# EasyEDA schematic SCH_SLV262-树莓派机房巡检小车_2026-06-26.json
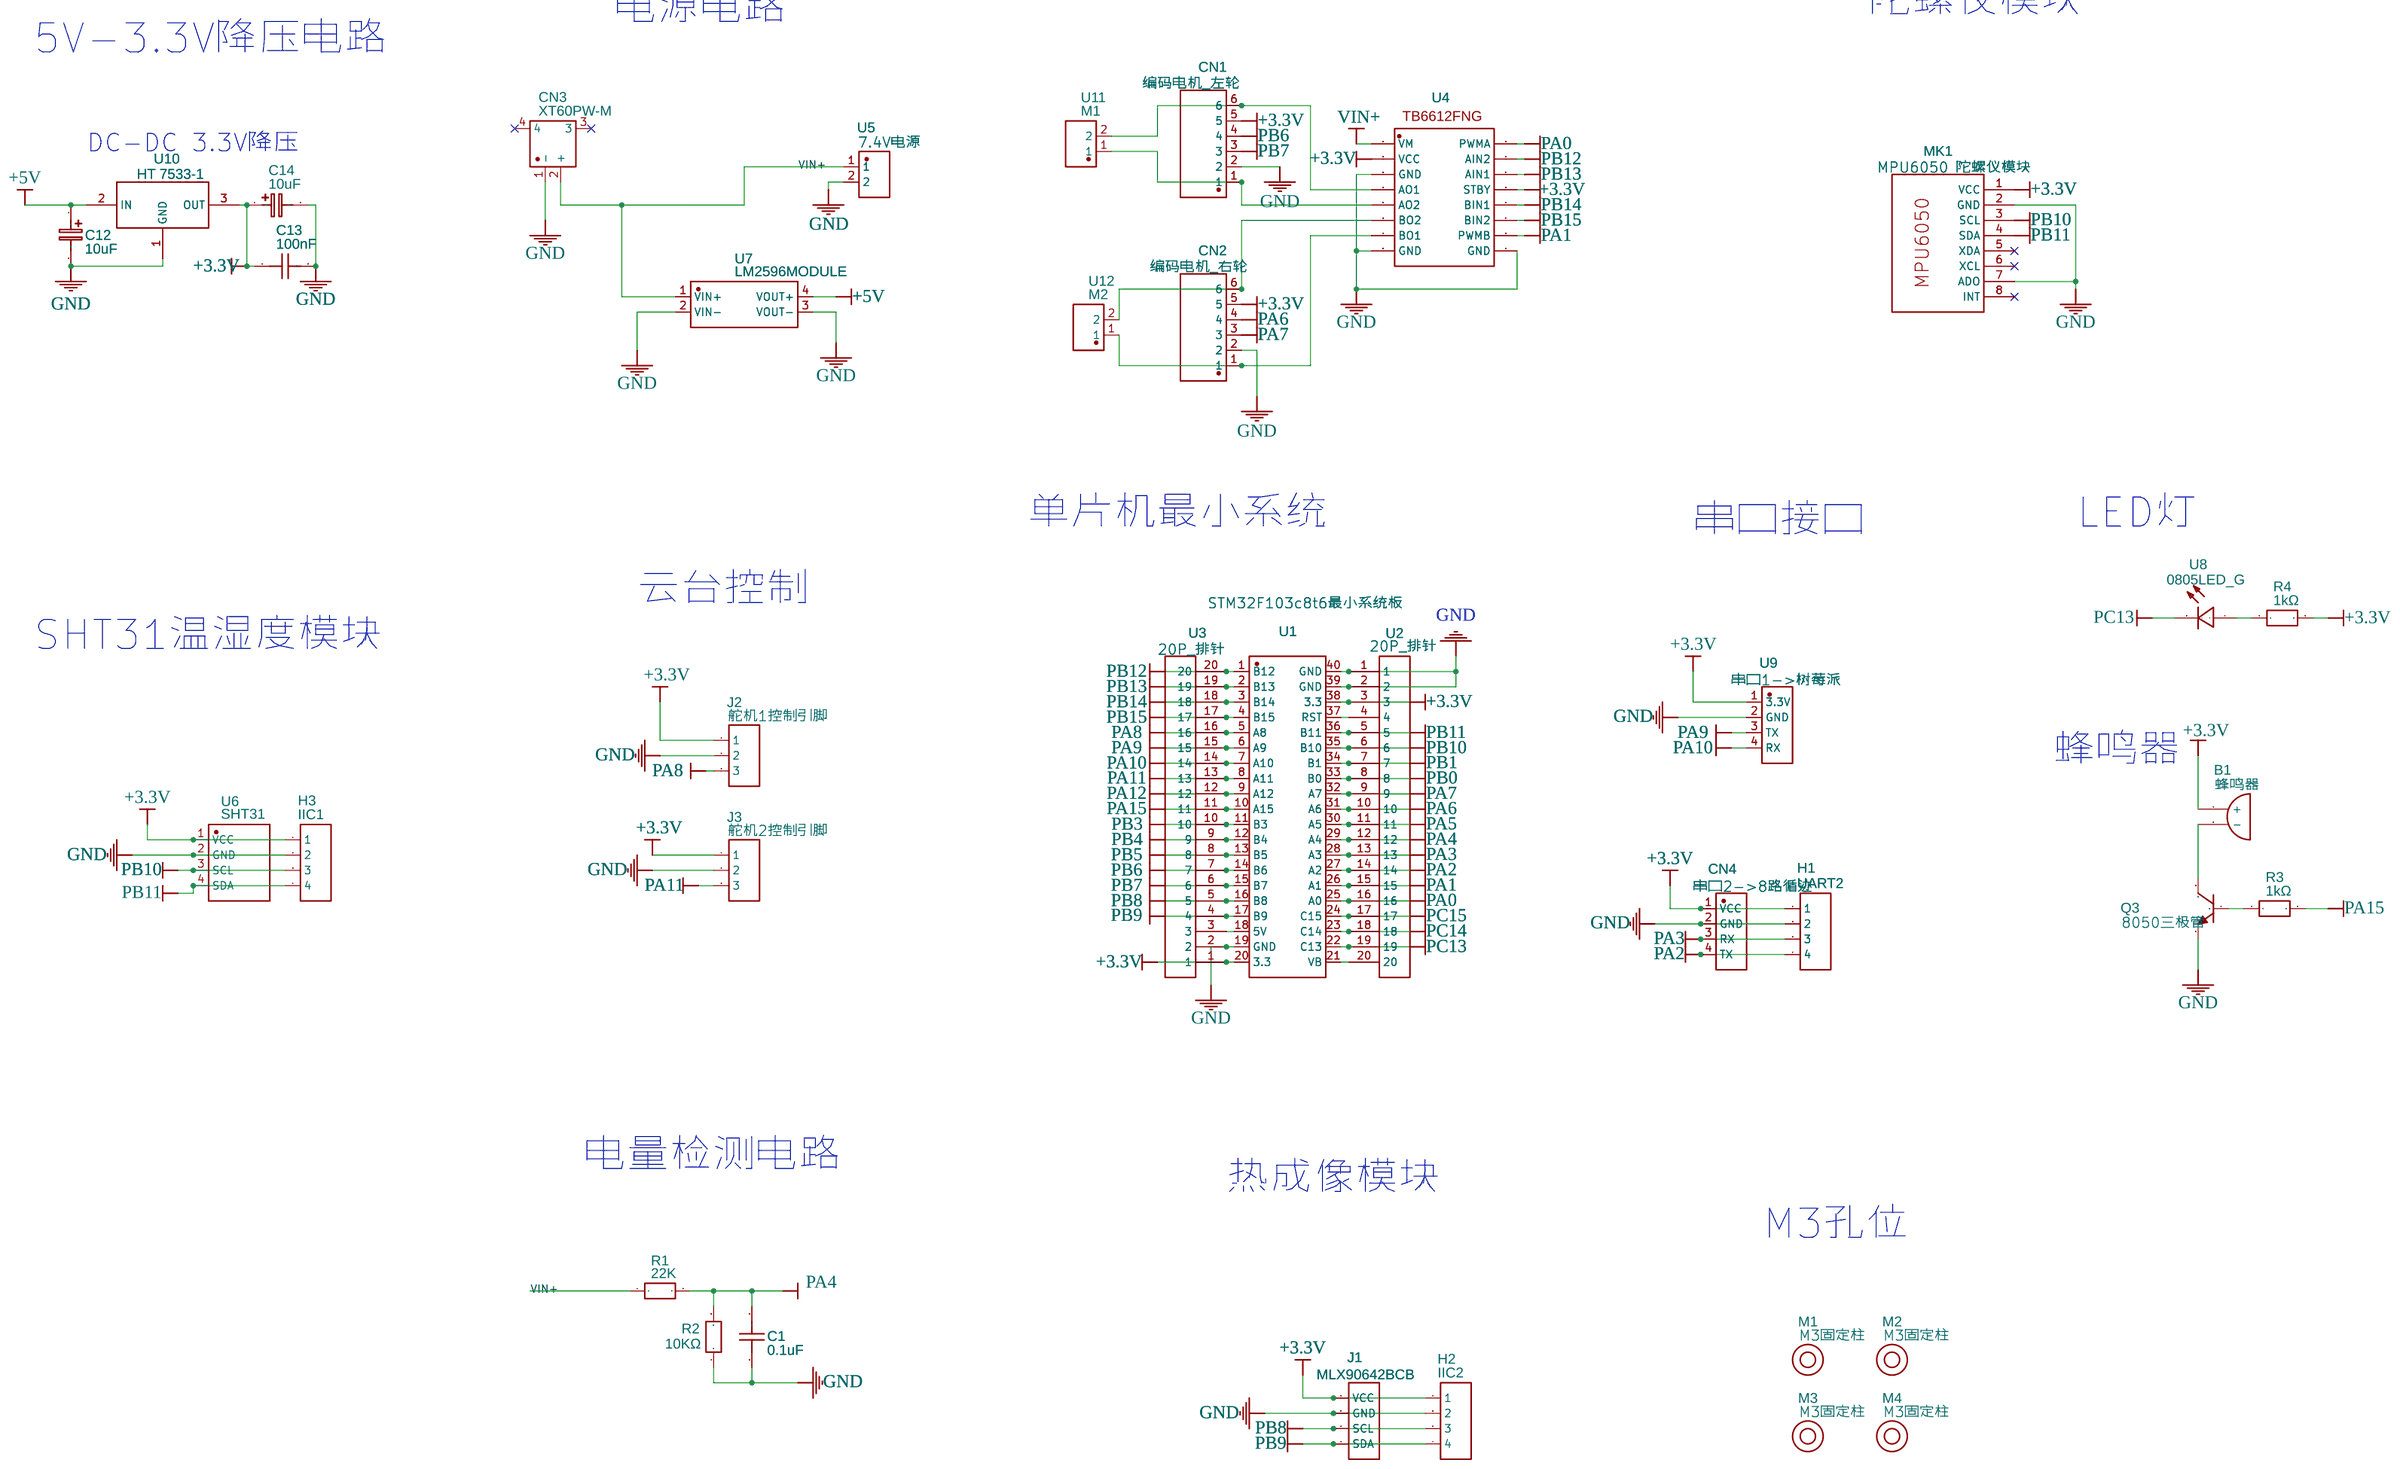
[diagram p0: schematic sheet]

## Parts
B1  蜂鸣器  [蜂鸣器-直插-无源蜂鸣器]
C1  0.1uF  [C0603]
C12  10uF  [CASE-A_3216]
C13  100nF  [C0603]
C14  10uF  [CASE-A_3216]
CN1  编码电机_左轮  [CONN-TH_A2501WV-6P]
CN2  编码电机_右轮  [CONN-TH_A2501WV-6P]
CN3  XT60PW-M  [CONN-TH_XT60PW-M]
CN4  串口2->8路循迹  [CONN-TH_HX-PH2.0-4PWZ]
H1  UART2  [HDR-F-2.54_1X4]
H2  IIC2  [HDR-F-2.54_1X4]
H3  IIC1  [HDR-F-2.54_1X4]
J1  MLX90642BCB  [HDR-M-2.54_1X4]
J2  舵机1控制引脚  [HDR-M-2.54_1X3]
J3  舵机2控制引脚  [HDR-M-2.54_1X3]
M1  M3固定柱  [M3螺丝孔外直径6MM-带8小孔]
M2  M3固定柱  [M3螺丝孔外直径6MM-带8小孔]
M3  M3固定柱  [M3螺丝孔外直径6MM-带8小孔]
M4  M3固定柱  [M3螺丝孔外直径6MM-带8小孔]
MK1  MPU6050 陀螺仪模块  [MPU6050 陀螺仪模块]
Q3  8050三极管  [TO-92-3_L4.8-W3.7-P1.27-L]
R1  22K  [R0603]
R2  10KΩ  [R0603]
R3  1kΩ  [R0603电阻]
R4  1kΩ  [R0603电阻]
U1  STM32F103c8t6最小系统板  [STM32F103C8T6最小系统板]
U2  20P_排针  [20P排针]
U3  20P_排针  [20P排针]
U4  TB6612  [TB6612]
U5  7.4V电源  [CONN-TH_P5.00_KF301-5.0-2P]
U6  SHT31  [SHT31]
U7  LM2596MODULE  [LM2596降压模块]
U8  0805LED_G  [LED-SMD_L2.0-W1.3-R-RD]
U9  串口1->树莓派  [CONN-TH_4P-P2.50-XH2.54-4P]
U10  HT 7533-1  [HT7533-1]
U11  M1  [CONN-TH_P5.00_KF301-5.0-2P]
U12  M2  [CONN-TH_P5.00_KF301-5.0-2P]

## Library data of the parts
B1 = 蜂鸣器: Contributor: huohuohuoo
C1 C13 = C_0603_US: Contributor: LCEDA_Lib
C12 C14 = C_Tan_SMD_A_EU: Contributor: LCEDA_Lib
CN1 CN2 = A2501WV-6P: Contributor: LCSC; Supplier: LCSC; Supplier Part: C225392; Manufacturer: CJT(长江连接器); JLCPCB Part Class: Extended Part
CN3 = XT60PW-M: Contributor: LCSC; Supplier: LCSC; Supplier Part: C98732; Manufacturer: AMASS(艾迈斯); JLCPCB Part Class: Extended Part
CN4 = HX-PH2.0-4PWZ: Supplier: LCSC; Supplier Part: C48641676; Manufacturer: hanxia(韩下); JLCPCB Part Class: Extended Part; Contributor: lcsc
H1-H3 = HDR-F-2.54_1x4: Supplier Part: C225501; Supplier: LCSC; Contributor: LCEDA_Lib
J1 = HDR-M-2.54_1x4: Supplier Part: C124378; Supplier: LCSC; Contributor: LCEDA_Lib
J2 J3 = HDR-M-2.54_1x3: Supplier Part: C180248; Supplier: LCSC; Contributor: LCEDA_Lib
M1-M4 = M3固定柱: Contributor: lazyshark
MK1 = MPU6050 陀螺仪模块: Contributor: lzlyyds
Q3 = 8050三极管: Supplier: LCSC; Supplier Part: C903227; Manufacturer: onsemi(安森美); Manufacturer Part: SS8050DTA; Contributor: zhuleisir51888
R1 R2 = R_0805_EU: Contributor: LCEDA_Lib
R3 R4 = R0603电阻: Supplier: LCSC; Supplier Part: C2692822; Manufacturer: RESI(开步睿思); Manufacturer Part: PTFR0603B44K2N9; JLCPCB Part Class: Extended Part; Contributor: rayzhu
U1 = STM32F103c8t6最小系统板: Contributor: csy_6666
U2 U3 = 20P排针: Contributor: cq123456789
U4 = TB6612: Contributor: kuaile_wwwww
U5 U11 U12 = KF301-5.0-2P: Contributor: LCSC; Supplier: LCSC; Supplier Part: C474881; Manufacturer: KEFA(科发); JLCPCB Part Class: Extended Part
U6 = SHT31: Contributor: poik
U7 = LM2596MODULE: Contributor: Titan_wjh
U8 = 0805LED_G: Contributor: LCSC; Supplier: LCSC; Supplier Part: C9900010436; Manufacturer: null; JLCPCB Part Class: Extended Part
U9 = XH2.54-4P- 直插: Contributor: LCSC; Supplier: LCSC; Supplier Part: C9900000103; Manufacturer: null; JLCPCB Part Class: Extended Part
U10 = HT 7533-1: Contributor: FEIJIU

## Nets
+3.3V: B1.1(+) C13.1 C14.1 CN1.5 CN2.5 CN4.1(VCC) H1.1 H2.1 H3.1 J1.1(VCC) J2.1 J3.1 MK1.1(VCC) R4.2 U1.20(3.3) U1.38(3.3) U2.3 U3.1 U4.2(VCC) U4.13(STBY) U6.1(VCC) U9.1(3.3V) U10.3(OUT)
+5V: C12.1 U7.4(VOUT+) U10.2(IN)
GND: C1.1 C12.2 C13.2 C14.2 CN1.2 CN2.2 CN3.1(-) CN4.2(GND) H1.2 H2.2 H3.2 J1.2(GND) J2.2 J3.2 MK1.2(GND) MK1.7(ADO) Q3.1(E) R2.1 U1.19(GND) U1.39(GND) U1.40(GND) U2.1 U2.2 U3.2 U4.3(GND) U4.8(GND) U4.9(GND) U5.2 U6.2(GND) U7.2(VIN-) U7.3(VOUT-) U9.2(GND) U10.1(GND)
VIN+: CN3.2(+) R1.1 U4.1(VM) U5.1 U7.1(VIN+)
PA0: U1.25(A0) U2.16 U4.16(PWMA)
PA1: U1.26(A1) U2.15 U4.10(PWMB)
PA2: CN4.4(TX) H1.4 U1.27(A2) U2.14
PA3: CN4.3(RX) H1.3 U1.28(A3) U2.13
PA4: C1.2 R1.2 R2.2 U1.29(A4) U2.12
PA5: U1.30(A5) U2.11
PA6: CN2.4 U1.31(A6) U2.10
PA7: CN2.3 U1.32(A7) U2.9
PA8: J2.3 U1.5(A8) U3.16
PA9: U1.6(A9) U3.15 U9.3(TX)
PA10: U1.7(A10) U3.14 U9.4(RX)
PA11: J3.3 U1.8(A11) U3.13
PA12: U1.9(A12) U3.12
PA15: R3.2 U1.10(A15) U3.11
PB0: U1.33(B0) U2.8
PB1: U1.34(B1) U2.7
PB3: U1.11(B3) U3.10
PB4: U1.12(B4) U3.9
PB5: U1.13(B5) U3.8
PB6: CN1.4 U1.14(B6) U3.7
PB7: CN1.3 U1.15(B7) U3.6
PB8: H2.3 J1.3(SCL) U1.16(B8) U3.5
PB9: H2.4 J1.4(SDA) U1.17(B9) U3.4
PB10: H3.3 MK1.3(SCL) U1.35(B10) U2.6 U6.3(SCL)
PB11: H3.4 MK1.4(SDA) U1.36(B11) U2.5 U6.4(SDA)
PB12: U1.1(B12) U3.20 U4.15(AIN2)
PB13: U1.2(B13) U3.19 U4.14(AIN1)
PB14: U1.3(B14) U3.18 U4.12(BIN1)
PB15: U1.4(B15) U3.17 U4.11(BIN2)
PC13: U1.22(C13) U2.19 U8.2(-)
PC14: U1.23(C14) U2.18
PC15: U1.24(C15) U2.17
Net-(B1-2): B1.2(-) Q3.3(C)
Net-(CN1-1): CN1.1 U4.5(AO2) U11.1
Net-(CN1-6): CN1.6 U4.4(AO1) U11.2
Net-(CN2-1): CN2.1 U4.7(BO1) U12.1
Net-(CN2-6): CN2.6 U4.6(BO2) U12.2
Net-(Q3-2): Q3.2(B) R3.1
Net-(R4-1): R4.1 U8.1(+)
Net-(U1-18): U1.18(5V) U3.3
Net-(U1-21): U1.21(VB) U2.20
Net-(U1-37): U1.37(RST) U2.4

Not connected (* = marked no-connect by the designer): CN3 3* 4*; MK1 5(XDA)* 6(XCL)* 8(INT)*

## Notes on the sheet
- 电机驱动电路
- 陀螺仪模块
- 电源电路
- 5V-3.3V降压电路
- DC-DC 3.3V降压
- 单片机最小系统
- 串口接口
- LED灯
- 云台控制
- SHT31温湿度模块
- 蜂鸣器
- 电量检测电路
- 热成像模块
- M3孔位
